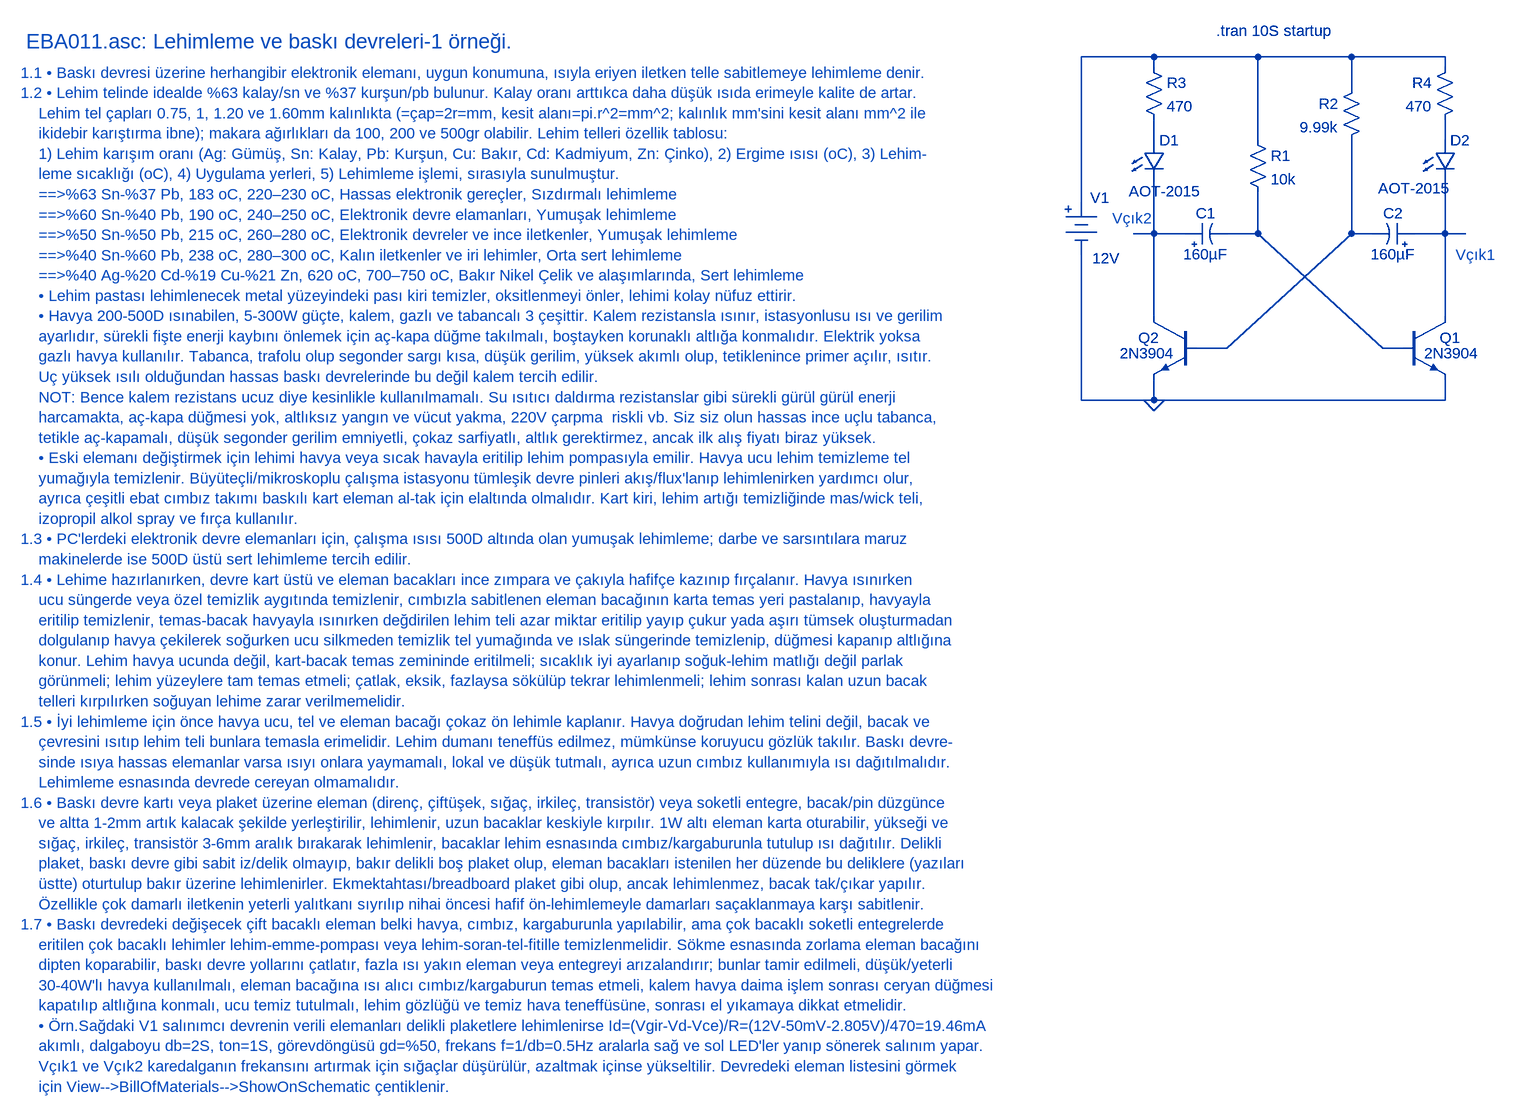
[diagram p0: schematic EBA011.asc]
EBA011.asc, the LTspice schematic file:
Version 4
SHEET 1 3956 1532
WIRE 1600 64 1488 64
WIRE 1760 64 1600 64
WIRE 1904 64 1760 64
WIRE 2048 64 1904 64
WIRE 1600 80 1600 64
WIRE 2048 80 2048 64
WIRE 1904 112 1904 64
WIRE 1600 192 1600 160
WIRE 1760 192 1760 64
WIRE 2048 192 2048 160
WIRE 1488 288 1488 64
WIRE 1600 336 1600 256
WIRE 1600 336 1568 336
WIRE 1648 336 1600 336
WIRE 1760 336 1760 272
WIRE 1760 336 1712 336
WIRE 1904 336 1904 192
WIRE 1936 336 1904 336
WIRE 2048 336 2048 256
WIRE 2048 336 2000 336
WIRE 2080 336 2048 336
WIRE 1600 464 1600 336
WIRE 2048 464 2048 336
WIRE 1712 512 1904 336
WIRE 1712 512 1664 512
WIRE 1952 512 1760 336
WIRE 1984 512 1952 512
WIRE 1488 592 1488 368
WIRE 1600 592 1600 560
WIRE 1600 592 1488 592
WIRE 2048 592 2048 560
WIRE 2048 592 1600 592
FLAG 1600 592 0
SYMBOL Misc\\battery 1488 272 R0
WINDOW 0 14 9 Left 2
WINDOW 3 17 102 Left 2
SYMATTR InstName V1
SYMATTR Value 12V
SYMBOL npn 1984 464 R0
WINDOW 3 32 56 Left 2
SYMATTR Value 2N3904
SYMATTR InstName Q1
SYMBOL npn 1664 464 M0
WINDOW 3 32 56 Left 2
SYMATTR Value 2N3904
SYMATTR InstName Q2
SYMBOL polcap 1648 352 R270
WINDOW 0 32 32 VTop 2
WINDOW 3 0 32 VBottom 2
SYMATTR InstName C1
SYMATTR Value 160µF
SYMBOL polcap 2000 352 M270
WINDOW 0 32 32 VTop 2
WINDOW 3 0 32 VBottom 2
SYMATTR InstName C2
SYMATTR Value 160µF
SYMBOL res 1744 176 R0
SYMATTR InstName R1
SYMATTR Value 10k
SYMBOL res 1920 96 M0
SYMATTR InstName R2
SYMATTR Value 9.99k
SYMBOL LED 1584 192 R0
WINDOW 3 -23 79 Left 2
SYMATTR Value AOT-2015
SYMATTR InstName D1
SYMATTR Description Diode
SYMATTR Type diode
SYMBOL LED 2032 192 R0
WINDOW 3 -87 74 Left 2
SYMATTR Value AOT-2015
SYMATTR InstName D2
SYMATTR Description Diode
SYMATTR Type diode
SYMBOL res 1584 64 R0
SYMATTR InstName R3
SYMATTR Value 470
SYMBOL res 2064 64 M0
SYMATTR InstName R4
SYMATTR Value 470
TEXT -136 40 Left 3 ;EBA011.asc: Lehimleme ve baskı devreleri-1 örneği.
TEXT -144 88 Left 2 ;1.1 • Baskı devresi üzerine herhangibir elektronik elemanı, uygun konumuna, ısıyla eriyen iletken telle sabitlemeye lehimleme denir.\n1.2 • Lehim telinde idealde %63 kalay/sn ve %37 kurşun/pb bulunur. Kalay oranı arttıkca daha düşük ısıda erimeyle kalite de artar.\n    Lehim tel çapları 0.75, 1, 1.20 ve 1.60mm kalınlıkta (=çap=2r=mm, kesit alanı=pi.r^2=mm^2; kalınlık mm'sini kesit alanı mm^2 ile\n    ikidebir karıştırma ibne); makara ağırlıkları da 100, 200 ve 500gr olabilir. Lehim telleri özellik tablosu:\n    1) Lehim karışım oranı (Ag: Gümüş, Sn: Kalay, Pb: Kurşun, Cu: Bakır, Cd: Kadmiyum, Zn: Çinko), 2) Ergime ısısı (oC), 3) Lehim-\n    leme sıcaklığı (oC), 4) Uygulama yerleri, 5) Lehimleme işlemi, sırasıyla sunulmuştur.\n    ==>%63 Sn-%37 Pb, 183 oC, 220–230 oC, Hassas elektronik gereçler, Sızdırmalı lehimleme\n    ==>%60 Sn-%40 Pb, 190 oC, 240–250 oC, Elektronik devre elamanları, Yumuşak lehimleme\n    ==>%50 Sn-%50 Pb, 215 oC, 260–280 oC, Elektronik devreler ve ince iletkenler, Yumuşak lehimleme\n    ==>%40 Sn-%60 Pb, 238 oC, 280–300 oC, Kalın iletkenler ve iri lehimler, Orta sert lehimleme\n    ==>%40 Ag-%20 Cd-%19 Cu-%21 Zn, 620 oC, 700–750 oC, Bakır Nikel Çelik ve alaşımlarında, Sert lehimleme\n    • Lehim pastası lehimlenecek metal yüzeyindeki pası kiri temizler, oksitlenmeyi önler, lehimi kolay nüfuz ettirir.\n    • Havya 200-500D ısınabilen, 5-300W güçte, kalem, gazlı ve tabancalı 3 çeşittir. Kalem rezistansla ısınır, istasyonlusu ısı ve gerilim\n    ayarlıdır, sürekli fişte enerji kaybını önlemek için aç-kapa düğme takılmalı, boştayken korunaklı altlığa konmalıdır. Elektrik yoksa \n    gazlı havya kullanılır. Tabanca, trafolu olup segonder sargı kısa, düşük gerilim, yüksek akımlı olup, tetiklenince primer açılır, ısıtır.\n    Uç yüksek ısılı olduğundan hassas baskı devrelerinde bu değil kalem tercih edilir.\n    NOT: Bence kalem rezistans ucuz diye kesinlikle kullanılmamalı. Su ısıtıcı daldırma rezistanslar gibi sürekli gürül gürül enerji\n    harcamakta, aç-kapa düğmesi yok, altlıksız yangın ve vücut yakma, 220V çarpma  riskli vb. Siz siz olun hassas ince uçlu tabanca, \n    tetikle aç-kapamalı, düşük segonder gerilim emniyetli, çokaz sarfiyatlı, altlık gerektirmez, ancak ilk alış fiyatı biraz yüksek.\n    • Eski elemanı değiştirmek için lehimi havya veya sıcak havayla eritilip lehim pompasıyla emilir. Havya ucu lehim temizleme tel\n    yumağıyla temizlenir. Büyüteçli/mikroskoplu çalışma istasyonu tümleşik devre pinleri akış/flux'lanıp lehimlenirken yardımcı olur, \n    ayrıca çeşitli ebat cımbız takımı baskılı kart eleman al-tak için elaltında olmalıdır. Kart kiri, lehim artığı temizliğinde mas/wick teli, \n    izopropil alkol spray ve fırça kullanılır.\n1.3 • PC'lerdeki elektronik devre elemanları için, çalışma ısısı 500D altında olan yumuşak lehimleme; darbe ve sarsıntılara maruz\n    makinelerde ise 500D üstü sert lehimleme tercih edilir.\n1.4 • Lehime hazırlanırken, devre kart üstü ve eleman bacakları ince zımpara ve çakıyla hafifçe kazınıp fırçalanır. Havya ısınırken \n    ucu süngerde veya özel temizlik aygıtında temizlenir, cımbızla sabitlenen eleman bacağının karta temas yeri pastalanıp, havyayla\n    eritilip temizlenir, temas-bacak havyayla ısınırken değdirilen lehim teli azar miktar eritilip yayıp çukur yada aşırı tümsek oluşturmadan\n    dolgulanıp havya çekilerek soğurken ucu silkmeden temizlik tel yumağında ve ıslak süngerinde temizlenip, düğmesi kapanıp altlığına \n    konur. Lehim havya ucunda değil, kart-bacak temas zemininde eritilmeli; sıcaklık iyi ayarlanıp soğuk-lehim matlığı değil parlak\n    görünmeli; lehim yüzeylere tam temas etmeli; çatlak, eksik, fazlaysa sökülüp tekrar lehimlenmeli; lehim sonrası kalan uzun bacak\n    telleri kırpılırken soğuyan lehime zarar verilmemelidir.\n1.5 • İyi lehimleme için önce havya ucu, tel ve eleman bacağı çokaz ön lehimle kaplanır. Havya doğrudan lehim telini değil, bacak ve\n    çevresini ısıtıp lehim teli bunlara temasla erimelidir. Lehim dumanı teneffüs edilmez, mümkünse koruyucu gözlük takılır. Baskı devre-\n    sinde ısıya hassas elemanlar varsa ısıyı onlara yaymamalı, lokal ve düşük tutmalı, ayrıca uzun cımbız kullanımıyla ısı dağıtılmalıdır.\n    Lehimleme esnasında devrede cereyan olmamalıdır.\n1.6 • Baskı devre kartı veya plaket üzerine eleman (direnç, çiftüşek, sığaç, irkileç, transistör) veya soketli entegre, bacak/pin düzgünce\n    ve altta 1-2mm artık kalacak şekilde yerleştirilir, lehimlenir, uzun bacaklar keskiyle kırpılır. 1W altı eleman karta oturabilir, yükseği ve\n    sığaç, irkileç, transistör 3-6mm aralık bırakarak lehimlenir, bacaklar lehim esnasında cımbız/kargaburunla tutulup ısı dağıtılır. Delikli\n    plaket, baskı devre gibi sabit iz/delik olmayıp, bakır delikli boş plaket olup, eleman bacakları istenilen her düzende bu deliklere (yazıları\n    üstte) oturtulup bakır üzerine lehimlenirler. Ekmektahtası/breadboard plaket gibi olup, ancak lehimlenmez, bacak tak/çıkar yapılır. \n    Özellikle çok damarlı iletkenin yeterli yalıtkanı sıyrılıp nihai öncesi hafif ön-lehimlemeyle damarları saçaklanmaya karşı sabitlenir.\n1.7 • Baskı devredeki değişecek çift bacaklı eleman belki havya, cımbız, kargaburunla yapılabilir, ama çok bacaklı soketli entegrelerde\n    eritilen çok bacaklı lehimler lehim-emme-pompası veya lehim-soran-tel-fitille temizlenmelidir. Sökme esnasında zorlama eleman bacağını\n    dipten koparabilir, baskı devre yollarını çatlatır, fazla ısı yakın eleman veya entegreyi arızalandırır; bunlar tamir edilmeli, düşük/yeterli\n    30-40W'lı havya kullanılmalı, eleman bacağına ısı alıcı cımbız/kargaburun temas etmeli, kalem havya daima işlem sonrası ceryan düğmesi \n    kapatılıp altlığına konmalı, ucu temiz tutulmalı, lehim gözlüğü ve temiz hava teneffüsüne, sonrası el yıkamaya dikkat etmelidir.\n    • Örn.Sağdaki V1 salınımcı devrenin verili elemanları delikli plaketlere lehimlenirse Id=(Vgir-Vd-Vce)/R=(12V-50mV-2.805V)/470=19.46mA\n    akımlı, dalgaboyu db=2S, ton=1S, görevdöngüsü gd=%50, frekans f=1/db=0.5Hz aralarla sağ ve sol LED'ler yanıp sönerek salınım yapar.\n    Vçık1 ve Vçık2 karedalganın frekansını artırmak için sığaçlar düşürülür, azaltmak içinse yükseltilir. Devredeki eleman listesini görmek\n    için View-->BillOfMaterials-->ShowOnSchematic çentiklenir.
TEXT 1696 24 Left 2 !.tran 10S startup
TEXT 2064 368 Left 2 ;Vçık1
TEXT 1536 312 Left 2 ;Vçık2

The netlist it stands for:
* EBA011.asc
V1 N001 0 12V
Q1 N007 N005 0 0 2N3904
Q2 N004 N006 0 0 2N3904
C1 N004 N005 160µF
C2 N007 N006 160µF
R1 N001 N005 10k
R2 N001 N006 9.99k
D1 N002 N004 AOT-2015
D2 N003 N007 AOT-2015
R3 N001 N002 470
R4 N001 N003 470
.model D D
.lib standard.dio
.model NPN NPN
.model PNP PNP
.lib standard.bjt
* EBA011.asc: Lehimleme ve baskı devreleri-1 örneği.
* 1.1 • Baskı devresi üzerine herhangibir elektronik elemanı, uygun konumuna, ısıyla eriyen iletken telle sabitlemeye lehimleme denir.
* 1.2 • Lehim telinde idealde %63 kalay/sn ve %37 kurşun/pb bulunur. Kalay oranı arttıkca daha düşük ısıda erimeyle kalite de artar.
*     Lehim tel çapları 0.75, 1, 1.20 ve 1.60mm kalınlıkta (=çap=2r=mm, kesit alanı=pi.r^2=mm^2; kalınlık mm'sini kesit alanı mm^2 ile
*     ikidebir karıştırma ibne); makara ağırlıkları da 100, 200 ve 500gr olabilir. Lehim telleri özellik tablosu:
*     1) Lehim karışım oranı (Ag: Gümüş, Sn: Kalay, Pb: Kurşun, Cu: Bakır, Cd: Kadmiyum, Zn: Çinko), 2) Ergime ısısı (oC), 3) Lehim-
*     leme sıcaklığı (oC), 4) Uygulama yerleri, 5) Lehimleme işlemi, sırasıyla sunulmuştur.
*     ==>%63 Sn-%37 Pb, 183 oC, 220–230 oC, Hassas elektronik gereçler, Sızdırmalı lehimleme
*     ==>%60 Sn-%40 Pb, 190 oC, 240–250 oC, Elektronik devre elamanları, Yumuşak lehimleme
*     ==>%50 Sn-%50 Pb, 215 oC, 260–280 oC, Elektronik devreler ve ince iletkenler, Yumuşak lehimleme
*     ==>%40 Sn-%60 Pb, 238 oC, 280–300 oC, Kalın iletkenler ve iri lehimler, Orta sert lehimleme
*     ==>%40 Ag-%20 Cd-%19 Cu-%21 Zn, 620 oC, 700–750 oC, Bakır Nikel Çelik ve alaşımlarında, Sert lehimleme
*     • Lehim pastası lehimlenecek metal yüzeyindeki pası kiri temizler, oksitlenmeyi önler, lehimi kolay nüfuz ettirir.
*     • Havya 200-500D ısınabilen, 5-300W güçte, kalem, gazlı ve tabancalı 3 çeşittir. Kalem rezistansla ısınır, istasyonlusu ısı ve gerilim
*     ayarlıdır, sürekli fişte enerji kaybını önlemek için aç-kapa düğme takılmalı, boştayken korunaklı altlığa konmalıdır. Elektrik yoksa
*     gazlı havya kullanılır. Tabanca, trafolu olup segonder sargı kısa, düşük gerilim, yüksek akımlı olup, tetiklenince primer açılır, ısıtır.
*     Uç yüksek ısılı olduğundan hassas baskı devrelerinde bu değil kalem tercih edilir.
*     NOT: Bence kalem rezistans ucuz diye kesinlikle kullanılmamalı. Su ısıtıcı daldırma rezistanslar gibi sürekli gürül gürül enerji
*     harcamakta, aç-kapa düğmesi yok, altlıksız yangın ve vücut yakma, 220V çarpma  riskli vb. Siz siz olun hassas ince uçlu tabanca,
*     tetikle aç-kapamalı, düşük segonder gerilim emniyetli, çokaz sarfiyatlı, altlık gerektirmez, ancak ilk alış fiyatı biraz yüksek.
*     • Eski elemanı değiştirmek için lehimi havya veya sıcak havayla eritilip lehim pompasıyla emilir. Havya ucu lehim temizleme tel
*     yumağıyla temizlenir. Büyüteçli/mikroskoplu çalışma istasyonu tümleşik devre pinleri akış/flux'lanıp lehimlenirken yardımcı olur,
*     ayrıca çeşitli ebat cımbız takımı baskılı kart eleman al-tak için elaltında olmalıdır. Kart kiri, lehim artığı temizliğinde mas/wick teli,
*     izopropil alkol spray ve fırça kullanılır.
* 1.3 • PC'lerdeki elektronik devre elemanları için, çalışma ısısı 500D altında olan yumuşak lehimleme; darbe ve sarsıntılara maruz
*     makinelerde ise 500D üstü sert lehimleme tercih edilir.
* 1.4 • Lehime hazırlanırken, devre kart üstü ve eleman bacakları ince zımpara ve çakıyla hafifçe kazınıp fırçalanır. Havya ısınırken
*     ucu süngerde veya özel temizlik aygıtında temizlenir, cımbızla sabitlenen eleman bacağının karta temas yeri pastalanıp, havyayla
*     eritilip temizlenir, temas-bacak havyayla ısınırken değdirilen lehim teli azar miktar eritilip yayıp çukur yada aşırı tümsek oluşturmadan
*     dolgulanıp havya çekilerek soğurken ucu silkmeden temizlik tel yumağında ve ıslak süngerinde temizlenip, düğmesi kapanıp altlığına
*     konur. Lehim havya ucunda değil, kart-bacak temas zemininde eritilmeli; sıcaklık iyi ayarlanıp soğuk-lehim matlığı değil parlak
*     görünmeli; lehim yüzeylere tam temas etmeli; çatlak, eksik, fazlaysa sökülüp tekrar lehimlenmeli; lehim sonrası kalan uzun bacak
*     telleri kırpılırken soğuyan lehime zarar verilmemelidir.
* 1.5 • İyi lehimleme için önce havya ucu, tel ve eleman bacağı çokaz ön lehimle kaplanır. Havya doğrudan lehim telini değil, bacak ve
*     çevresini ısıtıp lehim teli bunlara temasla erimelidir. Lehim dumanı teneffüs edilmez, mümkünse koruyucu gözlük takılır. Baskı devre-
*     sinde ısıya hassas elemanlar varsa ısıyı onlara yaymamalı, lokal ve düşük tutmalı, ayrıca uzun cımbız kullanımıyla ısı dağıtılmalıdır.
*     Lehimleme esnasında devrede cereyan olmamalıdır.
* 1.6 • Baskı devre kartı veya plaket üzerine eleman (direnç, çiftüşek, sığaç, irkileç, transistör) veya soketli entegre, bacak/pin düzgünce
*     ve altta 1-2mm artık kalacak şekilde yerleştirilir, lehimlenir, uzun bacaklar keskiyle kırpılır. 1W altı eleman karta oturabilir, yükseği ve
*     sığaç, irkileç, transistör 3-6mm aralık bırakarak lehimlenir, bacaklar lehim esnasında cımbız/kargaburunla tutulup ısı dağıtılır. Delikli
*     plaket, baskı devre gibi sabit iz/delik olmayıp, bakır delikli boş plaket olup, eleman bacakları istenilen her düzende bu deliklere (yazıları
*     üstte) oturtulup bakır üzerine lehimlenirler. Ekmektahtası/breadboard plaket gibi olup, ancak lehimlenmez, bacak tak/çıkar yapılır.
*     Özellikle çok damarlı iletkenin yeterli yalıtkanı sıyrılıp nihai öncesi hafif ön-lehimlemeyle damarları saçaklanmaya karşı sabitlenir.
* 1.7 • Baskı devredeki değişecek çift bacaklı eleman belki havya, cımbız, kargaburunla yapılabilir, ama çok bacaklı soketli entegrelerde
*     eritilen çok bacaklı lehimler lehim-emme-pompası veya lehim-soran-tel-fitille temizlenmelidir. Sökme esnasında zorlama eleman bacağını
*     dipten koparabilir, baskı devre yollarını çatlatır, fazla ısı yakın eleman veya entegreyi arızalandırır; bunlar tamir edilmeli, düşük/yeterli
*     30-40W'lı havya kullanılmalı, eleman bacağına ısı alıcı cımbız/kargaburun temas etmeli, kalem havya daima işlem sonrası ceryan düğmesi
*     kapatılıp altlığına konmalı, ucu temiz tutulmalı, lehim gözlüğü ve temiz hava teneffüsüne, sonrası el yıkamaya dikkat etmelidir.
*     • Örn.Sağdaki V1 salınımcı devrenin verili elemanları delikli plaketlere lehimlenirse Id=(Vgir-Vd-Vce)/R=(12V-50mV-2.805V)/470=19.46mA
*     akımlı, dalgaboyu db=2S, ton=1S, görevdöngüsü gd=%50, frekans f=1/db=0.5Hz aralarla sağ ve sol LED'ler yanıp sönerek salınım yapar.
*     Vçık1 ve Vçık2 karedalganın frekansını artırmak için sığaçlar düşürülür, azaltmak içinse yükseltilir. Devredeki eleman listesini görmek
*     için View-->BillOfMaterials-->ShowOnSchematic çentiklenir.
.tran 10S startup
* Vçık1
* Vçık2
.backanno
.end